# EAGLE schematic hero_board (EAGLE 9.2.2)

## Sheet 1 of 2
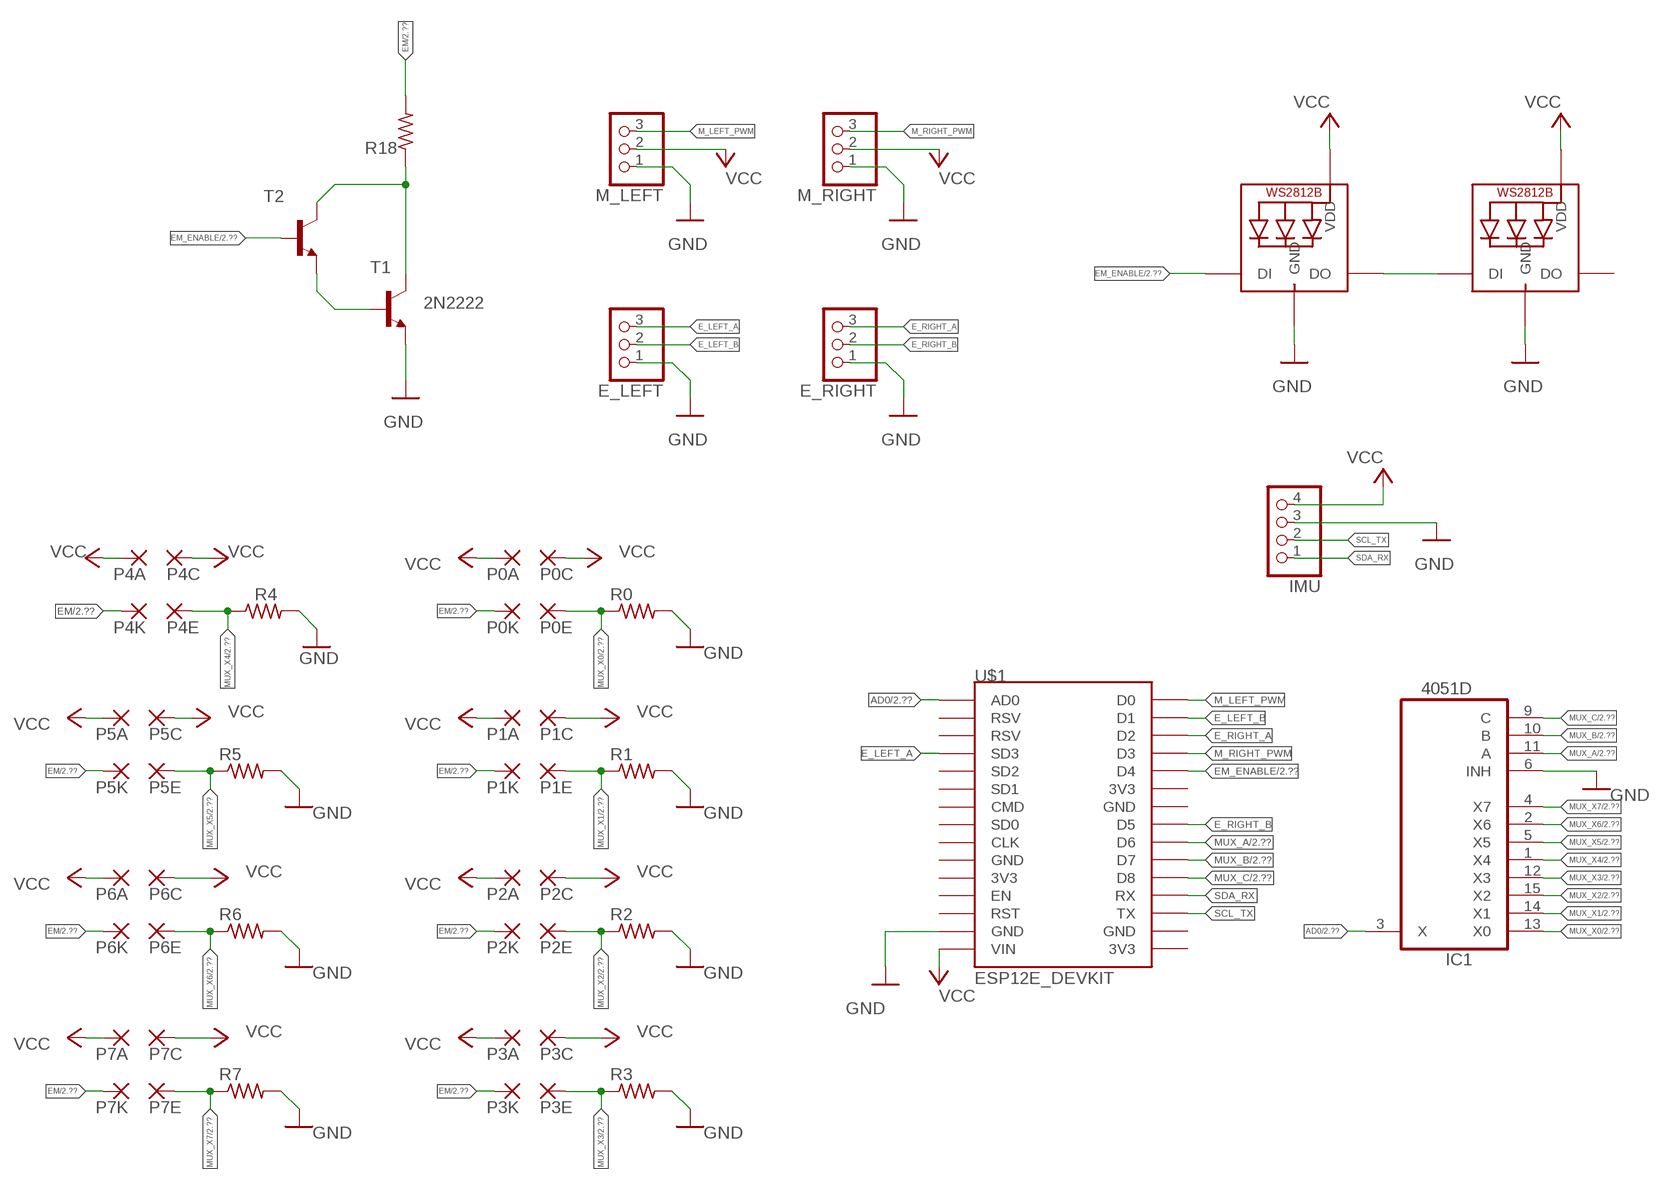
[diagram p0: schematic, sheet 1]

### Parts
E_LEFT  PINHD-1X3  [1X03]
E_RIGHT  PINHD-1X3  [1X03]
IC1  4051D  [SO16]
IMU  PINHD-1X4  [1X04]
LED1  WS2812B5050  [WS2812B]
LED2  WS2812B5050  [WS2812B]
M_LEFT  PINHD-1X3  [1X03]
M_RIGHT  PINHD-1X3  [1X03]
P0A  WIREPADSMD1,27-254  [SMD1,27-2,54]
P0C  WIREPADSMD1,27-254  [SMD1,27-2,54]
P0E  WIREPADSMD1,27-254  [SMD1,27-2,54]
P0K  WIREPADSMD1,27-254  [SMD1,27-2,54]
P1A  WIREPADSMD1,27-254  [SMD1,27-2,54]
P1C  WIREPADSMD1,27-254  [SMD1,27-2,54]
P1E  WIREPADSMD1,27-254  [SMD1,27-2,54]
P1K  WIREPADSMD1,27-254  [SMD1,27-2,54]
P2A  WIREPADSMD1,27-254  [SMD1,27-2,54]
P2C  WIREPADSMD1,27-254  [SMD1,27-2,54]
P2E  WIREPADSMD1,27-254  [SMD1,27-2,54]
P2K  WIREPADSMD1,27-254  [SMD1,27-2,54]
P3A  WIREPADSMD1,27-254  [SMD1,27-2,54]
P3C  WIREPADSMD1,27-254  [SMD1,27-2,54]
P3E  WIREPADSMD1,27-254  [SMD1,27-2,54]
P3K  WIREPADSMD1,27-254  [SMD1,27-2,54]
P4A  WIREPADSMD1,27-254  [SMD1,27-2,54]
P4C  WIREPADSMD1,27-254  [SMD1,27-2,54]
P4E  WIREPADSMD1,27-254  [SMD1,27-2,54]
P4K  WIREPADSMD1,27-254  [SMD1,27-2,54]
P5A  WIREPADSMD1,27-254  [SMD1,27-2,54]
P5C  WIREPADSMD1,27-254  [SMD1,27-2,54]
P5E  WIREPADSMD1,27-254  [SMD1,27-2,54]
P5K  WIREPADSMD1,27-254  [SMD1,27-2,54]
P6A  WIREPADSMD1,27-254  [SMD1,27-2,54]
P6C  WIREPADSMD1,27-254  [SMD1,27-2,54]
P6E  WIREPADSMD1,27-254  [SMD1,27-2,54]
P6K  WIREPADSMD1,27-254  [SMD1,27-2,54]
P7A  WIREPADSMD1,27-254  [SMD1,27-2,54]
P7C  WIREPADSMD1,27-254  [SMD1,27-2,54]
P7E  WIREPADSMD1,27-254  [SMD1,27-2,54]
P7K  WIREPADSMD1,27-254  [SMD1,27-2,54]
R0  R-US_R0805  [R0805]
R1  R-US_R0805  [R0805]
R2  R-US_R0805  [R0805]
R3  R-US_R0805  [R0805]
R4  R-US_R0805  [R0805]
R5  R-US_R0805  [R0805]
R6  R-US_R0805  [R0805]
R7  R-US_R0805  [R0805]
R18  R-US_R0805  [R0805]
T1  2N2222  [TO18]
T2  BC549-NPN-TO92-CBE  [TO92-CBE]
U$1  ESP12E_DEVKIT  [ESP12E_DEVKIT]

### Nets
AD0: IC1.3(X) U$1.AD0 ; also sheet 2
E_LEFT_A: E_LEFT.3 U$1.SD3
E_LEFT_B: E_LEFT.2 U$1.D1
E_RIGHT_A: E_RIGHT.3 U$1.D2
E_RIGHT_B: E_RIGHT.2 U$1.D5
EM: P0K.1(P) P1K.1(P) P2K.1(P) P3K.1(P) P4K.1(P) P5K.1(P) P6K.1(P) P7K.1(P) R18.2 ; also sheet 2
EM_ENABLE: LED1.4-DIN(DI) T2.B U$1.D4 ; also sheet 2
GND: E_LEFT.1 E_RIGHT.1 IC1.6(INH) IMU.3 LED1.3-GND(GND) LED2.3-GND(GND) M_LEFT.1 M_RIGHT.1 R0.2 R1.2 R2.2 R3.2 R4.2 R5.2 R6.2 R7.2 T1.1(E) U$1.GND@1(GND) ; also sheet 2
M_LEFT_PWM: M_LEFT.3 U$1.D0
M_RIGHT_PWM: M_RIGHT.3 U$1.D3
MUX_A: IC1.11(A) U$1.D6 ; also sheet 2
MUX_B: IC1.10(B) U$1.D7 ; also sheet 2
MUX_C: IC1.9(C) U$1.D8 ; also sheet 2
MUX_X0: IC1.13(X0) P0E.1(P) R0.1 ; also sheet 2
MUX_X1: IC1.14(X1) P1E.1(P) R1.1 ; also sheet 2
MUX_X2: IC1.15(X2) P2E.1(P) R2.1 ; also sheet 2
MUX_X3: IC1.12(X3) P3E.1(P) R3.1 ; also sheet 2
MUX_X4: IC1.1(X4) P4E.1(P) R4.1 ; also sheet 2
MUX_X5: IC1.5(X5) P5E.1(P) R5.1 ; also sheet 2
MUX_X6: IC1.2(X6) P6E.1(P) R6.1 ; also sheet 2
MUX_X7: IC1.4(X7) P7E.1(P) R7.1 ; also sheet 2
N$1: T1.2(B) T2.E
N$2: R18.1 T1.3(C) T2.C
N$3: LED1.2-DOUT(DO) LED2.4-DIN(DI)
SCL_TX: IMU.2 U$1.TX
SDA_RX: IMU.1 U$1.RX
VCC: IMU.4 LED1.1-VDD(VDD) LED2.1-VDD(VDD) M_LEFT.2 M_RIGHT.2 P0A.1(P) P0C.1(P) P1A.1(P) P1C.1(P) P2A.1(P) P2C.1(P) P3A.1(P) P3C.1(P) P4A.1(P) P4C.1(P) P5A.1(P) P5C.1(P) P6A.1(P) P6C.1(P) P7A.1(P) P7C.1(P) U$1.VIN ; also sheet 2
Unconnected: LED2.2-DOUT(DO) U$1.3V3@0(3V3) U$1.3V3@1(3V3) U$1.3V3@2(3V3) U$1.CLK U$1.CMD U$1.EN U$1.GND@0(GND) U$1.GND@2(GND) U$1.GND@3(GND) U$1.RST U$1.RSV@0(RSV) U$1.RSV@1(RSV) U$1.SD0 U$1.SD1 U$1.SD2

## Sheet 2 of 2
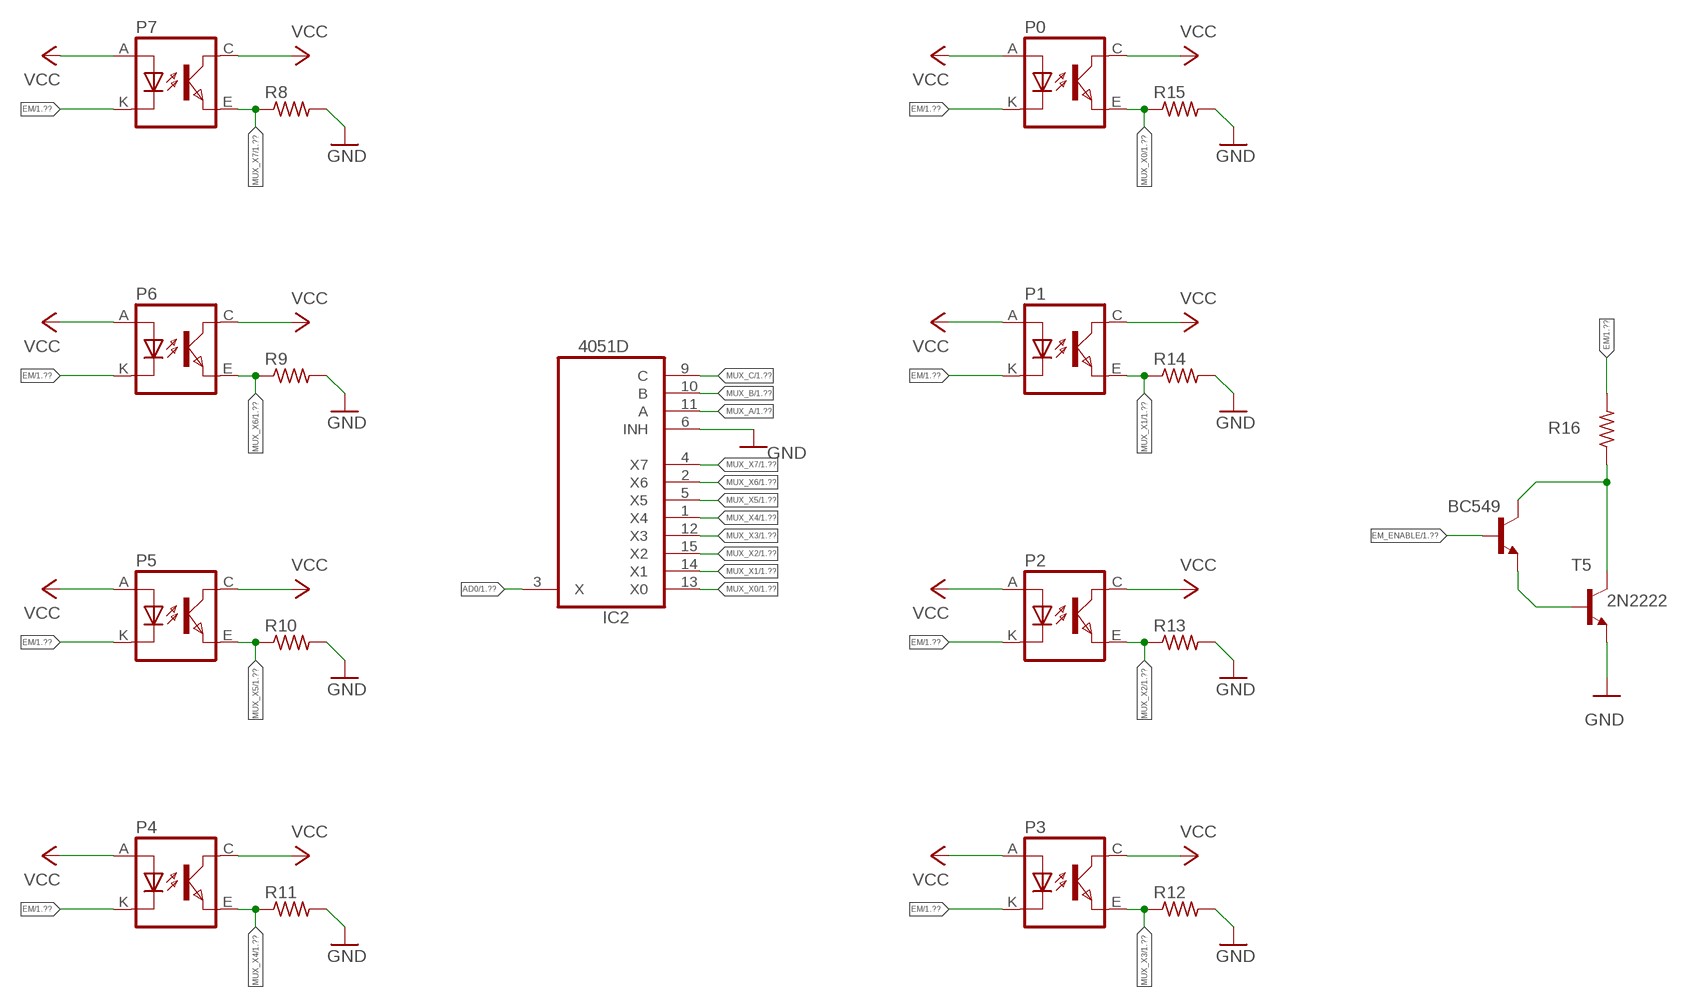
[diagram p1: schematic, sheet 2]

### Parts
BC549  BC549-NPN-TO92-CBE  [TO92-CBE]
IC2  4051D  [SO16]
P0  TCRT5000  [TCRT5000]
P1  TCRT5000  [TCRT5000]
P2  TCRT5000  [TCRT5000]
P3  TCRT5000  [TCRT5000]
P4  TCRT5000  [TCRT5000]
P5  TCRT5000  [TCRT5000]
P6  TCRT5000  [TCRT5000]
P7  TCRT5000  [TCRT5000]
R8  R-US_M0805  [M0805]
R9  R-US_M0805  [M0805]
R10  R-US_M0805  [M0805]
R11  R-US_M0805  [M0805]
R12  R-US_M0805  [M0805]
R13  R-US_M0805  [M0805]
R14  R-US_M0805  [M0805]
R15  R-US_M0805  [M0805]
R16  R-US_R0805  [R0805]
T5  2N2222  [TO18]

### Nets
AD0: IC2.3(X) ; also sheet 1
EM: P0.K(CATHODE) P1.K(CATHODE) P2.K(CATHODE) P3.K(CATHODE) P4.K(CATHODE) P5.K(CATHODE) P6.K(CATHODE) P7.K(CATHODE) R16.2 ; also sheet 1
EM_ENABLE: BC549.B ; also sheet 1
GND: IC2.6(INH) R8.2 R9.2 R10.2 R11.2 R12.2 R13.2 R14.2 R15.2 T5.1(E) ; also sheet 1
MUX_A: IC2.11(A) ; also sheet 1
MUX_B: IC2.10(B) ; also sheet 1
MUX_C: IC2.9(C) ; also sheet 1
MUX_X0: IC2.13(X0) P0.E(EMITTER) R15.1 ; also sheet 1
MUX_X1: IC2.14(X1) P1.E(EMITTER) R14.1 ; also sheet 1
MUX_X2: IC2.15(X2) P2.E(EMITTER) R13.1 ; also sheet 1
MUX_X3: IC2.12(X3) P3.E(EMITTER) R12.1 ; also sheet 1
MUX_X4: IC2.1(X4) P4.E(EMITTER) R11.1 ; also sheet 1
MUX_X5: IC2.5(X5) P5.E(EMITTER) R10.1 ; also sheet 1
MUX_X6: IC2.2(X6) P6.E(EMITTER) R9.1 ; also sheet 1
MUX_X7: IC2.4(X7) P7.E(EMITTER) R8.1 ; also sheet 1
N$6: BC549.C R16.1 T5.3(C)
N$7: BC549.E T5.2(B)
VCC: P0.A(ANODE) P0.C(COLLECTOR) P1.A(ANODE) P1.C(COLLECTOR) P2.A(ANODE) P2.C(COLLECTOR) P3.A(ANODE) P3.C(COLLECTOR) P4.A(ANODE) P4.C(COLLECTOR) P5.A(ANODE) P5.C(COLLECTOR) P6.A(ANODE) P6.C(COLLECTOR) P7.A(ANODE) P7.C(COLLECTOR) ; also sheet 1

## Power pins joined to a net without a drawn wire
GND: IC1.8(GND) IC2.8(GND)
VCC: IC1.16(VCC) IC2.16(VCC)
VEE: IC1.7(VEE) IC2.7(VEE)

## Library data of the parts
BC549 = transistor:*-NPN-: NPN Transistror BF959 corrected 2008.03.06; SPICEPREFIX: J
E_LEFT E_RIGHT M_LEFT M_RIGHT = pinhead:PINHD-1X3: PIN HEADER
IC1 IC2 = 40xx:4051: 8-channel ANALOG MULTIPLEXER
IMU = pinhead:PINHD-1X4: PIN HEADER
LED1 LED2 = adafruit:WS2812B
P0 P1-P7 = tcrt5000:TCRT5000
P0A P0C P0E P0K P1A P1C P1E P1K P2A P2C P2E P2K P3A P3C P3E P3K P4A P4C P4E P4K P5A P5C P5E P5K P6A P6C P6E P6K P7A P7C P7E P7K = wirepad:WIREPAD: Wire PAD connect wire on PCB
R0 R1-R7 R18 = resistor:R-US_: RESISTOR, American symbol
R8-R15 = adafruit:R-US_: RESISTOR, American symbol
R16 = resistor:R-US_: RESISTOR, American symbol; SPICEPREFIX: R
T1 = transistor:2N2222: NPN TRANSISTOR
T2 = transistor:*-NPN-: NPN Transistror BF959 corrected 2008.03.06
T5 = transistor:2N2222: NPN TRANSISTOR; SPICEPREFIX: J
U$1 = ESP12E_DEVKIT:ESP12E_DEVKIT: ESP12E DEVKIT BOARD

## Net classes
0 default: width 0.508 mm, drill 0.508 mm, clearance 0.254 mm